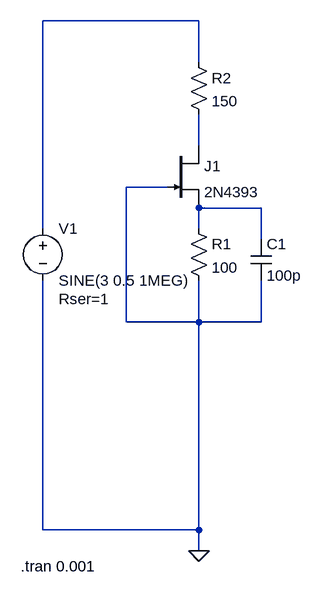
[diagram p0: schematic fet_trimpot_capacitance.asc]
fet_trimpot_capacitance.asc, the LTspice schematic file:
Version 4
SHEET 1 880 680
WIRE 272 -240 32 -240
WIRE 272 -176 272 -240
WIRE 272 -48 272 -96
WIRE 224 16 160 16
WIRE 368 48 272 48
WIRE 32 80 32 -240
WIRE 272 80 272 48
WIRE 368 96 368 48
WIRE 160 224 160 16
WIRE 272 224 272 160
WIRE 272 224 160 224
WIRE 368 224 368 160
WIRE 368 224 272 224
WIRE 32 544 32 160
WIRE 272 544 272 224
WIRE 272 544 32 544
WIRE 272 576 272 544
FLAG 272 576 0
SYMBOL njf 224 -48 R0
SYMATTR InstName J1
SYMATTR Value 2N4393
SYMBOL res 256 64 R0
SYMATTR InstName R1
SYMATTR Value 100
SYMBOL voltage 32 64 R0
WINDOW 123 0 0 Left 0
WINDOW 39 24 124 Left 2
SYMATTR InstName V1
SYMATTR Value SINE(3 0.5 1MEG)
SYMATTR SpiceLine Rser=1
SYMBOL res 256 -192 R0
SYMATTR InstName R2
SYMATTR Value 150
SYMBOL cap 352 96 R0
SYMATTR InstName C1
SYMATTR Value 100p
TEXT -2 600 Left 2 !.tran 0.001

The netlist it stands for:
* fet_trimpot_capacitance.asc
J1 N002 0 N003 2N4393
R1 N003 0 100
V1 N001 0 SINE(3 0.5 1MEG) Rser=1
R2 N001 N002 150
C1 N003 0 100p
.model NJF NJF
.model PJF PJF
.lib standard.jft
.tran 0.001
.backanno
.end